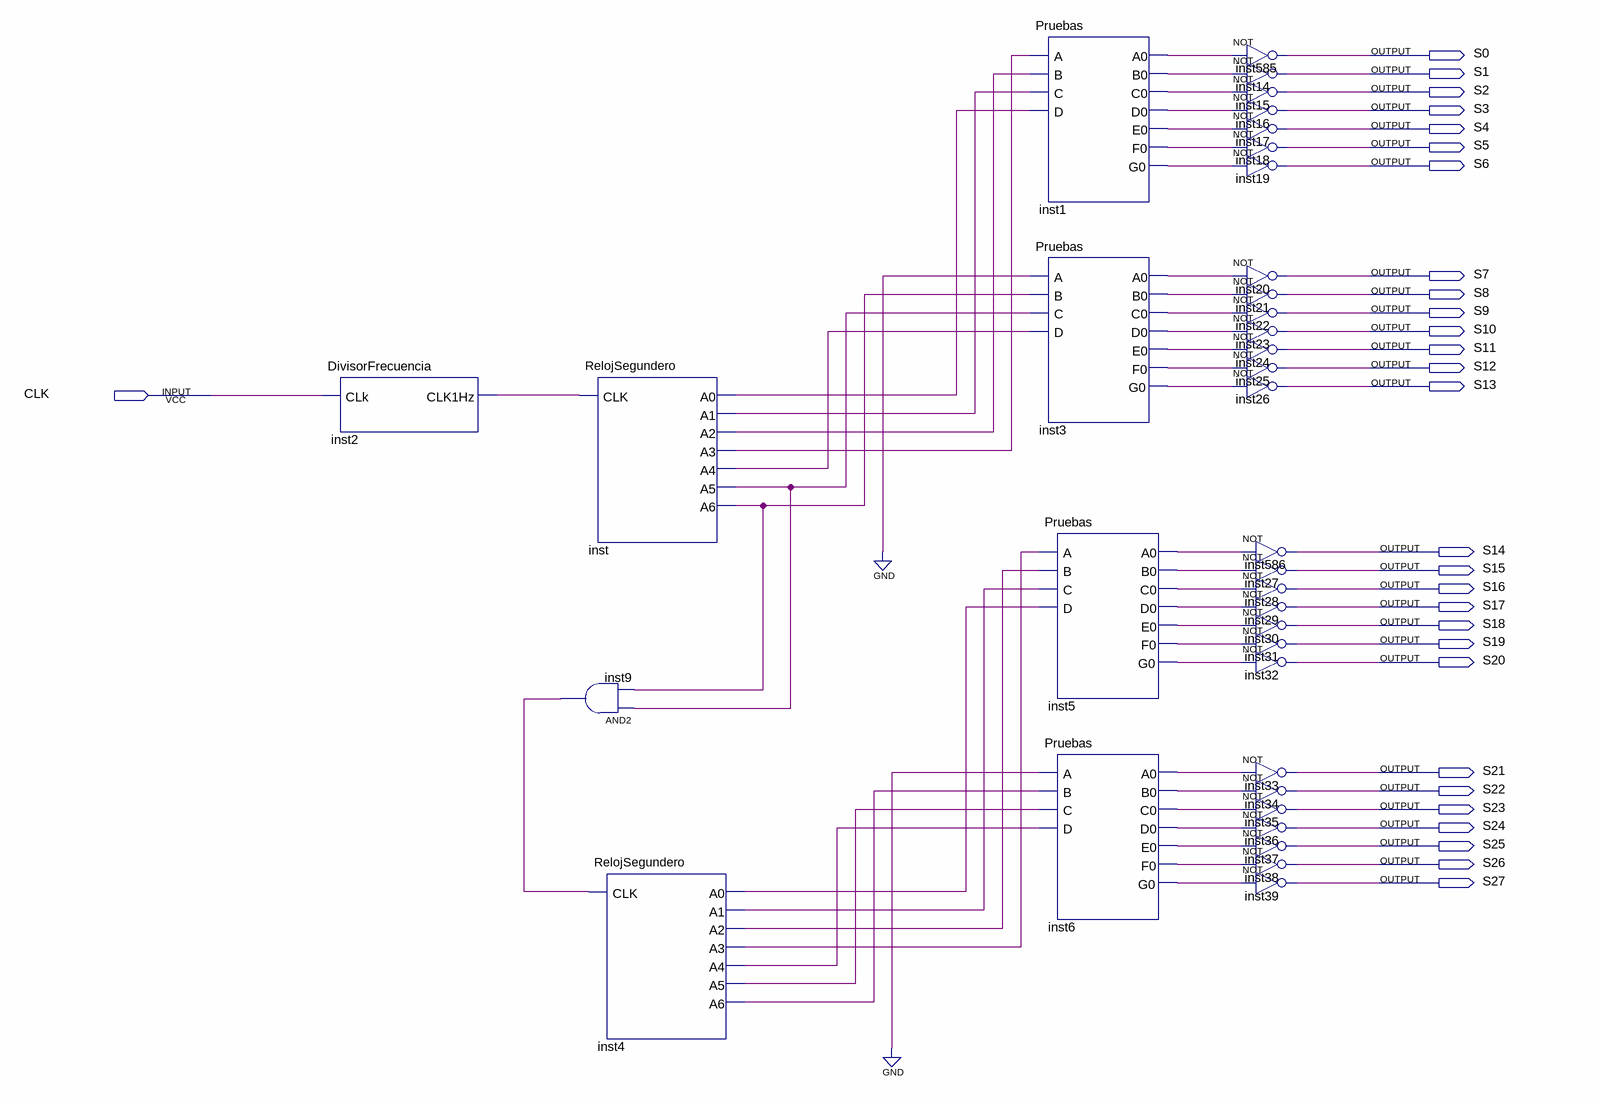
[diagram p0: schematic sheet]
// Quartus schematic ImplementacionRelojDigital.bdf as structural Verilog: 36 symbols, 29 pins
module ImplementacionRelojDigital (
  input  CLK,
  output S0,
  output S1,
  output S2,
  output S3,
  output S4,
  output S5,
  output S6,
  output S7,
  output S8,
  output S9,
  output S10,
  output S11,
  output S12,
  output S13,
  output S14,
  output S15,
  output S16,
  output S17,
  output S18,
  output S19,
  output S20,
  output S21,
  output S22,
  output S23,
  output S24,
  output S25,
  output S26,
  output S27
);

  wire inst1_a0, inst1_b0, inst1_c0, inst1_d0, inst1_e0, inst1_f0, inst1_g0, inst2_clk1hz, inst3_a0,
       inst3_b0, inst3_c0, inst3_d0, inst3_e0, inst3_f0, inst3_g0, inst4_a0, inst4_a1, inst4_a2, inst4_a3,
       inst4_a4, inst4_a5, inst4_a6, inst5_a0, inst5_b0, inst5_c0, inst5_d0, inst5_e0, inst5_f0, inst5_g0,
       inst6_a0, inst6_b0, inst6_c0, inst6_d0, inst6_e0, inst6_f0, inst6_g0, inst9_out, inst_a0, inst_a1,
       inst_a2, inst_a3, inst_a4, inst_a5, inst_a6;

  DivisorFrecuencia inst2 (.CLk(CLK), .CLK1Hz(inst2_clk1hz));
  RelojSegundero inst (
    .CLK(inst2_clk1hz), .A0(inst_a0), .A1(inst_a1), .A2(inst_a2), .A3(inst_a3), .A4(inst_a4), .A5(inst_a5),
    .A6(inst_a6));
  and inst9 (inst9_out, inst_a5, inst_a6);
  RelojSegundero inst4 (
    .CLK(inst9_out), .A0(inst4_a0), .A1(inst4_a1), .A2(inst4_a2), .A3(inst4_a3), .A4(inst4_a4),
    .A5(inst4_a5), .A6(inst4_a6));
  Pruebas inst1 (
    .A(inst_a3), .B(inst_a2), .C(inst_a1), .D(inst_a0), .A0(inst1_a0), .B0(inst1_b0), .C0(inst1_c0),
    .D0(inst1_d0), .E0(inst1_e0), .F0(inst1_f0), .G0(inst1_g0));
  Pruebas inst3 (
    .A(1'b0), .B(inst_a6), .C(inst_a5), .D(inst_a4), .A0(inst3_a0), .B0(inst3_b0), .C0(inst3_c0),
    .D0(inst3_d0), .E0(inst3_e0), .F0(inst3_f0), .G0(inst3_g0));
  Pruebas inst5 (
    .A(inst4_a3), .B(inst4_a2), .C(inst4_a1), .D(inst4_a0), .A0(inst5_a0), .B0(inst5_b0), .C0(inst5_c0),
    .D0(inst5_d0), .E0(inst5_e0), .F0(inst5_f0), .G0(inst5_g0));
  Pruebas inst6 (
    .A(1'b0), .B(inst4_a6), .C(inst4_a5), .D(inst4_a4), .A0(inst6_a0), .B0(inst6_b0), .C0(inst6_c0),
    .D0(inst6_d0), .E0(inst6_e0), .F0(inst6_f0), .G0(inst6_g0));
  not inst585 (S0, inst1_a0);
  not inst14 (S1, inst1_b0);
  not inst15 (S2, inst1_c0);
  not inst16 (S3, inst1_d0);
  not inst17 (S4, inst1_e0);
  not inst18 (S5, inst1_f0);
  not inst19 (S6, inst1_g0);
  not inst20 (S7, inst3_a0);
  not inst21 (S8, inst3_b0);
  not inst22 (S9, inst3_c0);
  not inst23 (S10, inst3_d0);
  not inst24 (S11, inst3_e0);
  not inst25 (S12, inst3_f0);
  not inst26 (S13, inst3_g0);
  not inst586 (S14, inst5_a0);
  not inst27 (S15, inst5_b0);
  not inst28 (S16, inst5_c0);
  not inst29 (S17, inst5_d0);
  not inst30 (S18, inst5_e0);
  not inst31 (S19, inst5_f0);
  not inst32 (S20, inst5_g0);
  not inst33 (S21, inst6_a0);
  not inst34 (S22, inst6_b0);
  not inst35 (S23, inst6_c0);
  not inst36 (S24, inst6_d0);
  not inst37 (S25, inst6_e0);
  not inst38 (S26, inst6_f0);
  not inst39 (S27, inst6_g0);
endmodule
